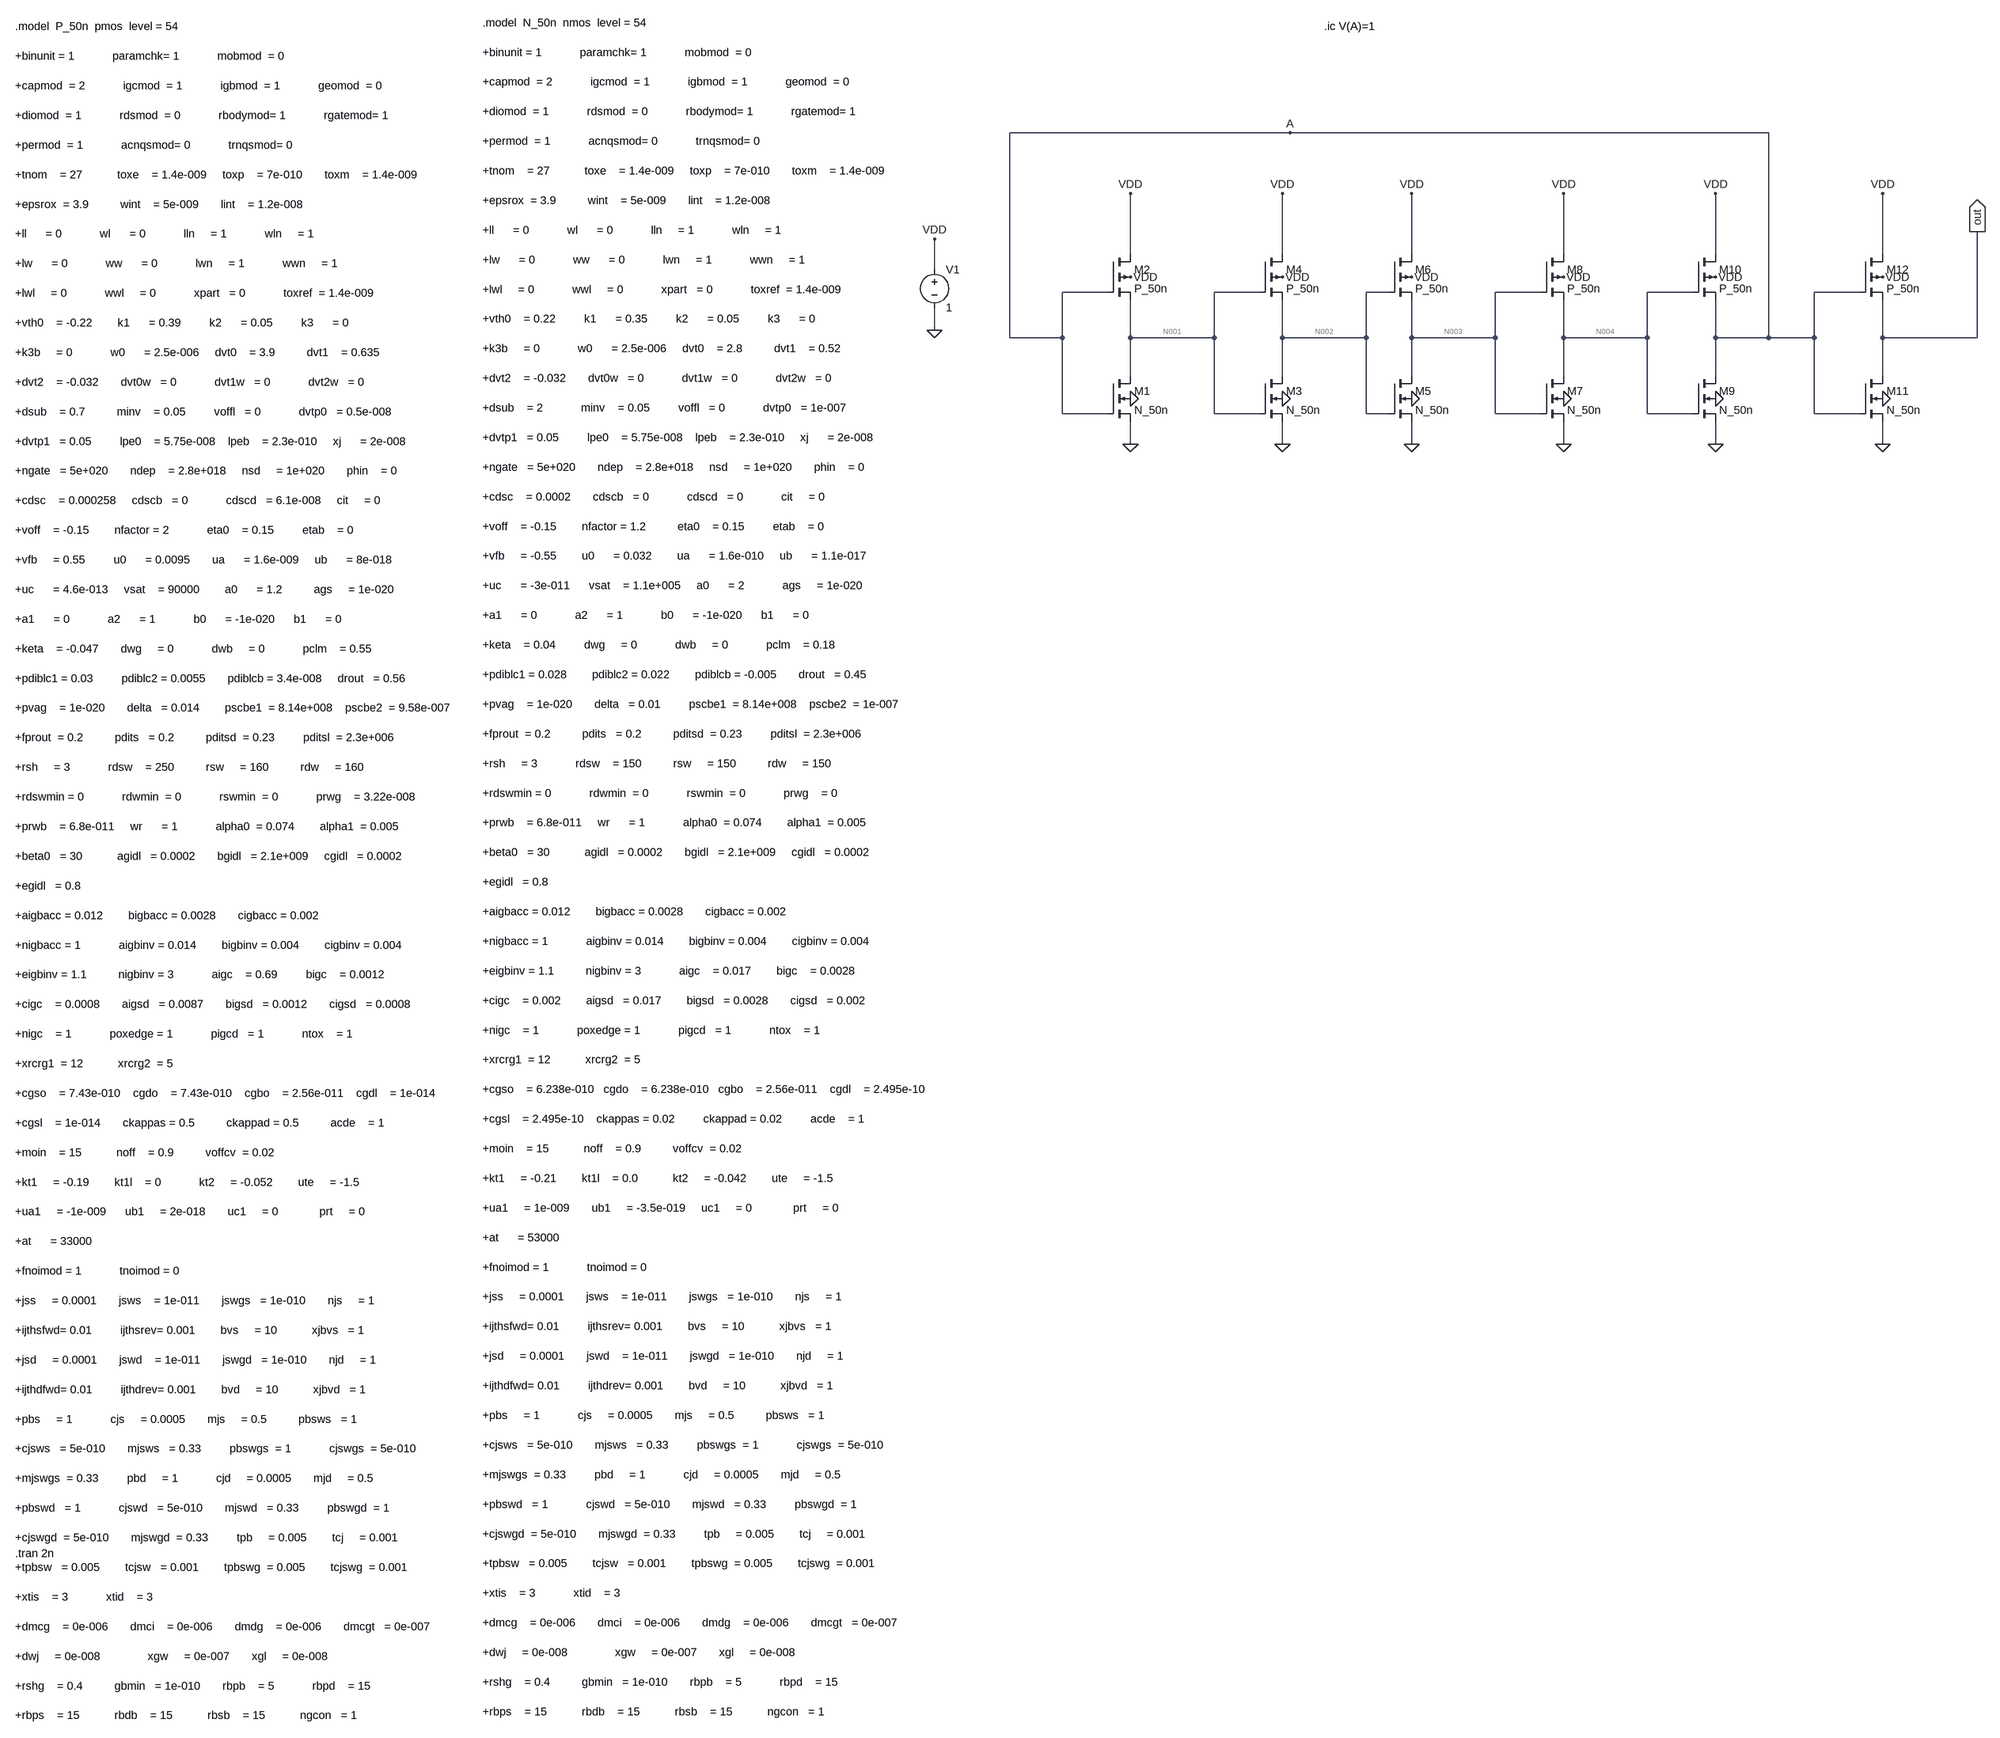
[diagram p0: schematic Draft32.asc]
Draft32.asc, the LTspice schematic file:
Version 4
SHEET 1 1432 2752
WIRE -224 -256 -816 -256
WIRE 784 -256 -224 -256
WIRE -560 0 -560 -128
WIRE -240 0 -240 -128
WIRE 32 0 32 -128
WIRE 352 0 352 -128
WIRE 672 0 672 -128
WIRE 1024 0 1024 -128
WIRE -1056 32 -1056 -32
WIRE -608 80 -704 80
WIRE -288 80 -384 80
WIRE -16 80 -64 80
WIRE 304 80 208 80
WIRE 624 80 528 80
WIRE 976 80 880 80
WIRE -1056 160 -1056 112
WIRE -816 176 -816 -256
WIRE -704 176 -704 80
WIRE -704 176 -816 176
WIRE -560 176 -560 96
WIRE -384 176 -384 80
WIRE -384 176 -560 176
WIRE -240 176 -240 96
WIRE -64 176 -64 80
WIRE -64 176 -240 176
WIRE 32 176 32 96
WIRE 208 176 208 80
WIRE 208 176 32 176
WIRE 352 176 352 96
WIRE 528 176 528 80
WIRE 528 176 352 176
WIRE 672 176 672 96
WIRE 784 176 784 -256
WIRE 784 176 672 176
WIRE 880 176 880 80
WIRE 880 176 784 176
WIRE 1024 176 1024 96
WIRE 1360 176 1360 -48
WIRE 1360 176 1024 176
WIRE -560 256 -560 176
WIRE -240 256 -240 176
WIRE 32 256 32 176
WIRE 352 256 352 176
WIRE 672 256 672 176
WIRE 1024 256 1024 176
WIRE -704 336 -704 176
WIRE -608 336 -704 336
WIRE -384 336 -384 176
WIRE -288 336 -384 336
WIRE -64 336 -64 176
WIRE -16 336 -64 336
WIRE 208 336 208 176
WIRE 304 336 208 336
WIRE 528 336 528 176
WIRE 624 336 528 336
WIRE 880 336 880 176
WIRE 976 336 880 336
WIRE -560 400 -560 352
WIRE -240 400 -240 352
WIRE 32 400 32 352
WIRE 352 400 352 352
WIRE 672 400 672 352
WIRE 1024 400 1024 352
FLAG -560 400 0
FLAG -560 304 0
FLAG -560 48 VDD
FLAG -560 -128 VDD
FLAG -240 400 0
FLAG -240 304 0
FLAG -240 48 VDD
FLAG -240 -128 VDD
FLAG 32 400 0
FLAG 32 304 0
FLAG 32 48 VDD
FLAG 32 -128 VDD
FLAG 352 400 0
FLAG 352 304 0
FLAG 352 48 VDD
FLAG 352 -128 VDD
FLAG 672 400 0
FLAG 672 304 0
FLAG 672 48 VDD
FLAG 672 -128 VDD
FLAG 1360 -48 out
IOPIN 1360 -48 Out
FLAG -1056 160 0
FLAG -1056 -32 VDD
FLAG -224 -256 A
FLAG 1024 400 0
FLAG 1024 304 0
FLAG 1024 48 VDD
FLAG 1024 -128 VDD
SYMBOL nmos4 -608 256 R0
SYMATTR InstName M1
SYMATTR Value N_50n
SYMATTR Value2 l=50N w=500N
SYMBOL pmos4 -608 0 R0
SYMATTR InstName M2
SYMATTR Value P_50n
SYMATTR Value2 l=50N w=1U
SYMBOL nmos4 -288 256 R0
SYMATTR InstName M3
SYMATTR Value N_50n
SYMATTR Value2 l=50N w=500N
SYMBOL pmos4 -288 0 R0
SYMATTR InstName M4
SYMATTR Value P_50n
SYMATTR Value2 l=50N w=1U
SYMBOL nmos4 -16 256 R0
SYMATTR InstName M5
SYMATTR Value N_50n
SYMATTR Value2 l=50N w=500N
SYMBOL pmos4 -16 0 R0
SYMATTR InstName M6
SYMATTR Value P_50n
SYMATTR Value2 l=50N w=1U
SYMBOL nmos4 304 256 R0
SYMATTR InstName M7
SYMATTR Value N_50n
SYMATTR Value2 l=50N w=500N
SYMBOL pmos4 304 0 R0
SYMATTR InstName M8
SYMATTR Value P_50n
SYMATTR Value2 l=50N w=1U
SYMBOL nmos4 624 256 R0
SYMATTR InstName M9
SYMATTR Value N_50n
SYMATTR Value2 l=50N w=500N
SYMBOL pmos4 624 0 R0
SYMATTR InstName M10
SYMATTR Value P_50n
SYMATTR Value2 l=50N w=1U
SYMBOL voltage -1056 16 R0
WINDOW 123 0 0 Left 0
WINDOW 39 0 0 Left 0
SYMATTR InstName V1
SYMATTR Value 1
SYMBOL nmos4 976 256 R0
SYMATTR InstName M11
SYMATTR Value N_50n
SYMATTR Value2 l=50N w=500N
SYMBOL pmos4 976 0 R0
SYMATTR InstName M12
SYMATTR Value P_50n
SYMATTR Value2 l=50N w=1U
TEXT -2008 -488 Left 2 !.model  N_50n  nmos  level = 54\n \n+binunit = 1            paramchk= 1            mobmod  = 0          \n \n+capmod  = 2            igcmod  = 1            igbmod  = 1            geomod  = 0          \n \n+diomod  = 1            rdsmod  = 0            rbodymod= 1            rgatemod= 1          \n \n+permod  = 1            acnqsmod= 0            trnqsmod= 0          \n \n+tnom    = 27           toxe    = 1.4e-009     toxp    = 7e-010       toxm    = 1.4e-009   \n \n+epsrox  = 3.9          wint    = 5e-009       lint    = 1.2e-008   \n \n+ll      = 0            wl      = 0            lln     = 1            wln     = 1          \n \n+lw      = 0            ww      = 0            lwn     = 1            wwn     = 1          \n \n+lwl     = 0            wwl     = 0            xpart   = 0            toxref  = 1.4e-009   \n \n+vth0    = 0.22         k1      = 0.35         k2      = 0.05         k3      = 0          \n \n+k3b     = 0            w0      = 2.5e-006     dvt0    = 2.8          dvt1    = 0.52       \n \n+dvt2    = -0.032       dvt0w   = 0            dvt1w   = 0            dvt2w   = 0          \n \n+dsub    = 2            minv    = 0.05         voffl   = 0            dvtp0   = 1e-007     \n \n+dvtp1   = 0.05         lpe0    = 5.75e-008    lpeb    = 2.3e-010     xj      = 2e-008     \n \n+ngate   = 5e+020       ndep    = 2.8e+018     nsd     = 1e+020       phin    = 0          \n \n+cdsc    = 0.0002       cdscb   = 0            cdscd   = 0            cit     = 0          \n \n+voff    = -0.15        nfactor = 1.2          eta0    = 0.15         etab    = 0          \n \n+vfb     = -0.55        u0      = 0.032        ua      = 1.6e-010     ub      = 1.1e-017   \n \n+uc      = -3e-011      vsat    = 1.1e+005     a0      = 2            ags     = 1e-020     \n \n+a1      = 0            a2      = 1            b0      = -1e-020      b1      = 0          \n \n+keta    = 0.04         dwg     = 0            dwb     = 0            pclm    = 0.18       \n \n+pdiblc1 = 0.028        pdiblc2 = 0.022        pdiblcb = -0.005       drout   = 0.45       \n \n+pvag    = 1e-020       delta   = 0.01         pscbe1  = 8.14e+008    pscbe2  = 1e-007     \n \n+fprout  = 0.2          pdits   = 0.2          pditsd  = 0.23         pditsl  = 2.3e+006   \n \n+rsh     = 3            rdsw    = 150          rsw     = 150          rdw     = 150        \n \n+rdswmin = 0            rdwmin  = 0            rswmin  = 0            prwg    = 0          \n \n+prwb    = 6.8e-011     wr      = 1            alpha0  = 0.074        alpha1  = 0.005      \n \n+beta0   = 30           agidl   = 0.0002       bgidl   = 2.1e+009     cgidl   = 0.0002     \n \n+egidl   = 0.8          \n \n+aigbacc = 0.012        bigbacc = 0.0028       cigbacc = 0.002\n \n+nigbacc = 1            aigbinv = 0.014        bigbinv = 0.004        cigbinv = 0.004\n \n+eigbinv = 1.1          nigbinv = 3            aigc    = 0.017        bigc    = 0.0028\n \n+cigc    = 0.002        aigsd   = 0.017        bigsd   = 0.0028       cigsd   = 0.002\n \n+nigc    = 1            poxedge = 1            pigcd   = 1            ntox    = 1\n \n+xrcrg1  = 12           xrcrg2  = 5          \n \n+cgso    = 6.238e-010   cgdo    = 6.238e-010   cgbo    = 2.56e-011    cgdl    = 2.495e-10     \n \n+cgsl    = 2.495e-10    ckappas = 0.02         ckappad = 0.02         acde    = 1          \n \n+moin    = 15           noff    = 0.9          voffcv  = 0.02       \n \n+kt1     = -0.21        kt1l    = 0.0           kt2     = -0.042        ute     = -1.5\n \n+ua1     = 1e-009       ub1     = -3.5e-019     uc1     = 0             prt     = 0\n \n+at      = 53000\n \n+fnoimod = 1            tnoimod = 0          \n \n+jss     = 0.0001       jsws    = 1e-011       jswgs   = 1e-010       njs     = 1          \n \n+ijthsfwd= 0.01         ijthsrev= 0.001        bvs     = 10           xjbvs   = 1          \n \n+jsd     = 0.0001       jswd    = 1e-011       jswgd   = 1e-010       njd     = 1          \n \n+ijthdfwd= 0.01         ijthdrev= 0.001        bvd     = 10           xjbvd   = 1          \n \n+pbs     = 1            cjs     = 0.0005       mjs     = 0.5          pbsws   = 1          \n \n+cjsws   = 5e-010       mjsws   = 0.33         pbswgs  = 1            cjswgs  = 5e-010     \n \n+mjswgs  = 0.33         pbd     = 1            cjd     = 0.0005       mjd     = 0.5        \n \n+pbswd   = 1            cjswd   = 5e-010       mjswd   = 0.33         pbswgd  = 1          \n \n+cjswgd  = 5e-010       mjswgd  = 0.33         tpb     = 0.005        tcj     = 0.001      \n \n+tpbsw   = 0.005        tcjsw   = 0.001        tpbswg  = 0.005        tcjswg  = 0.001      \n \n+xtis    = 3            xtid    = 3          \n \n+dmcg    = 0e-006       dmci    = 0e-006       dmdg    = 0e-006       dmcgt   = 0e-007     \n \n+dwj     = 0e-008               xgw     = 0e-007       xgl     = 0e-008     \n \n+rshg    = 0.4          gbmin   = 1e-010       rbpb    = 5            rbpd    = 15         \n \n+rbps    = 15           rbdb    = 15           rbsb    = 15           ngcon   = 1
TEXT -2992 -480 Left 2 !.model  P_50n  pmos  level = 54\n \n+binunit = 1            paramchk= 1            mobmod  = 0          \n \n+capmod  = 2            igcmod  = 1            igbmod  = 1            geomod  = 0          \n \n+diomod  = 1            rdsmod  = 0            rbodymod= 1            rgatemod= 1          \n \n+permod  = 1            acnqsmod= 0            trnqsmod= 0          \n \n+tnom    = 27           toxe    = 1.4e-009     toxp    = 7e-010       toxm    = 1.4e-009   \n \n+epsrox  = 3.9          wint    = 5e-009       lint    = 1.2e-008   \n \n+ll      = 0            wl      = 0            lln     = 1            wln     = 1          \n \n+lw      = 0            ww      = 0            lwn     = 1            wwn     = 1          \n \n+lwl     = 0            wwl     = 0            xpart   = 0            toxref  = 1.4e-009   \n \n+vth0    = -0.22        k1      = 0.39         k2      = 0.05         k3      = 0          \n \n+k3b     = 0            w0      = 2.5e-006     dvt0    = 3.9          dvt1    = 0.635        \n \n+dvt2    = -0.032       dvt0w   = 0            dvt1w   = 0            dvt2w   = 0          \n \n+dsub    = 0.7          minv    = 0.05         voffl   = 0            dvtp0   = 0.5e-008     \n \n+dvtp1   = 0.05         lpe0    = 5.75e-008    lpeb    = 2.3e-010     xj      = 2e-008     \n \n+ngate   = 5e+020       ndep    = 2.8e+018     nsd     = 1e+020       phin    = 0          \n \n+cdsc    = 0.000258     cdscb   = 0            cdscd   = 6.1e-008     cit     = 0          \n \n+voff    = -0.15        nfactor = 2            eta0    = 0.15         etab    = 0          \n \n+vfb     = 0.55         u0      = 0.0095       ua      = 1.6e-009     ub      = 8e-018     \n \n+uc      = 4.6e-013     vsat    = 90000        a0      = 1.2          ags     = 1e-020     \n \n+a1      = 0            a2      = 1            b0      = -1e-020      b1      = 0          \n \n+keta    = -0.047       dwg     = 0            dwb     = 0            pclm    = 0.55       \n \n+pdiblc1 = 0.03         pdiblc2 = 0.0055       pdiblcb = 3.4e-008     drout   = 0.56       \n \n+pvag    = 1e-020       delta   = 0.014        pscbe1  = 8.14e+008    pscbe2  = 9.58e-007  \n \n+fprout  = 0.2          pdits   = 0.2          pditsd  = 0.23         pditsl  = 2.3e+006   \n \n+rsh     = 3            rdsw    = 250          rsw     = 160          rdw     = 160        \n \n+rdswmin = 0            rdwmin  = 0            rswmin  = 0            prwg    = 3.22e-008  \n \n+prwb    = 6.8e-011     wr      = 1            alpha0  = 0.074        alpha1  = 0.005      \n \n+beta0   = 30           agidl   = 0.0002       bgidl   = 2.1e+009     cgidl   = 0.0002     \n \n+egidl   = 0.8          \n \n+aigbacc = 0.012        bigbacc = 0.0028       cigbacc = 0.002\n \n+nigbacc = 1            aigbinv = 0.014        bigbinv = 0.004        cigbinv = 0.004\n \n+eigbinv = 1.1          nigbinv = 3            aigc    = 0.69         bigc    = 0.0012\n \n+cigc    = 0.0008       aigsd   = 0.0087       bigsd   = 0.0012       cigsd   = 0.0008\n \n+nigc    = 1            poxedge = 1            pigcd   = 1            ntox    = 1\n \n+xrcrg1  = 12           xrcrg2  = 5          \n \n+cgso    = 7.43e-010    cgdo    = 7.43e-010    cgbo    = 2.56e-011    cgdl    = 1e-014     \n \n+cgsl    = 1e-014       ckappas = 0.5          ckappad = 0.5          acde    = 1          \n \n+moin    = 15           noff    = 0.9          voffcv  = 0.02       \n \n+kt1     = -0.19        kt1l    = 0            kt2     = -0.052        ute     = -1.5\n \n+ua1     = -1e-009      ub1     = 2e-018       uc1     = 0             prt     = 0\n \n+at      = 33000\n \n+fnoimod = 1            tnoimod = 0          \n \n+jss     = 0.0001       jsws    = 1e-011       jswgs   = 1e-010       njs     = 1          \n \n+ijthsfwd= 0.01         ijthsrev= 0.001        bvs     = 10           xjbvs   = 1          \n \n+jsd     = 0.0001       jswd    = 1e-011       jswgd   = 1e-010       njd     = 1          \n \n+ijthdfwd= 0.01         ijthdrev= 0.001        bvd     = 10           xjbvd   = 1          \n \n+pbs     = 1            cjs     = 0.0005       mjs     = 0.5          pbsws   = 1          \n \n+cjsws   = 5e-010       mjsws   = 0.33         pbswgs  = 1            cjswgs  = 5e-010     \n \n+mjswgs  = 0.33         pbd     = 1            cjd     = 0.0005       mjd     = 0.5        \n \n+pbswd   = 1            cjswd   = 5e-010       mjswd   = 0.33         pbswgd  = 1          \n \n+cjswgd  = 5e-010       mjswgd  = 0.33         tpb     = 0.005        tcj     = 0.001      \n \n+tpbsw   = 0.005        tcjsw   = 0.001        tpbswg  = 0.005        tcjswg  = 0.001      \n \n+xtis    = 3            xtid    = 3          \n \n+dmcg    = 0e-006       dmci    = 0e-006       dmdg    = 0e-006       dmcgt   = 0e-007     \n \n+dwj     = 0e-008               xgw     = 0e-007       xgl     = 0e-008     \n \n+rshg    = 0.4          gbmin   = 1e-010       rbpb    = 5            rbpd    = 15         \n \n+rbps    = 15           rbdb    = 15           rbsb    = 15           ngcon   = 1
TEXT -2992 2736 Left 2 !.tran 2n
TEXT -152 -480 Left 2 !.ic V(A)=1

The netlist it stands for:
* Draft32.asc
M1 N001 A 0 0 N_50n l=50N w=500N
M2 VDD A N001 VDD P_50n l=50N w=1U
M3 N002 N001 0 0 N_50n l=50N w=500N
M4 VDD N001 N002 VDD P_50n l=50N w=1U
M5 N003 N002 0 0 N_50n l=50N w=500N
M6 VDD N002 N003 VDD P_50n l=50N w=1U
M7 N004 N003 0 0 N_50n l=50N w=500N
M8 VDD N003 N004 VDD P_50n l=50N w=1U
M9 A N004 0 0 N_50n l=50N w=500N
M10 VDD N004 A VDD P_50n l=50N w=1U
V1 VDD 0 1
M11 out A 0 0 N_50n l=50N w=500N
M12 VDD A out VDD P_50n l=50N w=1U
.model NMOS NMOS
.model PMOS PMOS
.lib standard.mos
.model  N_50n  nmos  level = 54
+binunit = 1            paramchk= 1            mobmod  = 0
+capmod  = 2            igcmod  = 1            igbmod  = 1            geomod  = 0
+diomod  = 1            rdsmod  = 0            rbodymod= 1            rgatemod= 1
+permod  = 1            acnqsmod= 0            trnqsmod= 0
+tnom    = 27           toxe    = 1.4e-009     toxp    = 7e-010       toxm    = 1.4e-009
+epsrox  = 3.9          wint    = 5e-009       lint    = 1.2e-008
+ll      = 0            wl      = 0            lln     = 1            wln     = 1
+lw      = 0            ww      = 0            lwn     = 1            wwn     = 1
+lwl     = 0            wwl     = 0            xpart   = 0            toxref  = 1.4e-009
+vth0    = 0.22         k1      = 0.35         k2      = 0.05         k3      = 0
+k3b     = 0            w0      = 2.5e-006     dvt0    = 2.8          dvt1    = 0.52
+dvt2    = -0.032       dvt0w   = 0            dvt1w   = 0            dvt2w   = 0
+dsub    = 2            minv    = 0.05         voffl   = 0            dvtp0   = 1e-007
+dvtp1   = 0.05         lpe0    = 5.75e-008    lpeb    = 2.3e-010     xj      = 2e-008
+ngate   = 5e+020       ndep    = 2.8e+018     nsd     = 1e+020       phin    = 0
+cdsc    = 0.0002       cdscb   = 0            cdscd   = 0            cit     = 0
+voff    = -0.15        nfactor = 1.2          eta0    = 0.15         etab    = 0
+vfb     = -0.55        u0      = 0.032        ua      = 1.6e-010     ub      = 1.1e-017
+uc      = -3e-011      vsat    = 1.1e+005     a0      = 2            ags     = 1e-020
+a1      = 0            a2      = 1            b0      = -1e-020      b1      = 0
+keta    = 0.04         dwg     = 0            dwb     = 0            pclm    = 0.18
+pdiblc1 = 0.028        pdiblc2 = 0.022        pdiblcb = -0.005       drout   = 0.45
+pvag    = 1e-020       delta   = 0.01         pscbe1  = 8.14e+008    pscbe2  = 1e-007
+fprout  = 0.2          pdits   = 0.2          pditsd  = 0.23         pditsl  = 2.3e+006
+rsh     = 3            rdsw    = 150          rsw     = 150          rdw     = 150
+rdswmin = 0            rdwmin  = 0            rswmin  = 0            prwg    = 0
+prwb    = 6.8e-011     wr      = 1            alpha0  = 0.074        alpha1  = 0.005
+beta0   = 30           agidl   = 0.0002       bgidl   = 2.1e+009     cgidl   = 0.0002
+egidl   = 0.8
+aigbacc = 0.012        bigbacc = 0.0028       cigbacc = 0.002
+nigbacc = 1            aigbinv = 0.014        bigbinv = 0.004        cigbinv = 0.004
+eigbinv = 1.1          nigbinv = 3            aigc    = 0.017        bigc    = 0.0028
+cigc    = 0.002        aigsd   = 0.017        bigsd   = 0.0028       cigsd   = 0.002
+nigc    = 1            poxedge = 1            pigcd   = 1            ntox    = 1
+xrcrg1  = 12           xrcrg2  = 5
+cgso    = 6.238e-010   cgdo    = 6.238e-010   cgbo    = 2.56e-011    cgdl    = 2.495e-10
+cgsl    = 2.495e-10    ckappas = 0.02         ckappad = 0.02         acde    = 1
+moin    = 15           noff    = 0.9          voffcv  = 0.02
+kt1     = -0.21        kt1l    = 0.0           kt2     = -0.042        ute     = -1.5
+ua1     = 1e-009       ub1     = -3.5e-019     uc1     = 0             prt     = 0
+at      = 53000
+fnoimod = 1            tnoimod = 0
+jss     = 0.0001       jsws    = 1e-011       jswgs   = 1e-010       njs     = 1
+ijthsfwd= 0.01         ijthsrev= 0.001        bvs     = 10           xjbvs   = 1
+jsd     = 0.0001       jswd    = 1e-011       jswgd   = 1e-010       njd     = 1
+ijthdfwd= 0.01         ijthdrev= 0.001        bvd     = 10           xjbvd   = 1
+pbs     = 1            cjs     = 0.0005       mjs     = 0.5          pbsws   = 1
+cjsws   = 5e-010       mjsws   = 0.33         pbswgs  = 1            cjswgs  = 5e-010
+mjswgs  = 0.33         pbd     = 1            cjd     = 0.0005       mjd     = 0.5
+pbswd   = 1            cjswd   = 5e-010       mjswd   = 0.33         pbswgd  = 1
+cjswgd  = 5e-010       mjswgd  = 0.33         tpb     = 0.005        tcj     = 0.001
+tpbsw   = 0.005        tcjsw   = 0.001        tpbswg  = 0.005        tcjswg  = 0.001
+xtis    = 3            xtid    = 3
+dmcg    = 0e-006       dmci    = 0e-006       dmdg    = 0e-006       dmcgt   = 0e-007
+dwj     = 0e-008               xgw     = 0e-007       xgl     = 0e-008
+rshg    = 0.4          gbmin   = 1e-010       rbpb    = 5            rbpd    = 15
+rbps    = 15           rbdb    = 15           rbsb    = 15           ngcon   = 1
.model  P_50n  pmos  level = 54
+binunit = 1            paramchk= 1            mobmod  = 0
+capmod  = 2            igcmod  = 1            igbmod  = 1            geomod  = 0
+diomod  = 1            rdsmod  = 0            rbodymod= 1            rgatemod= 1
+permod  = 1            acnqsmod= 0            trnqsmod= 0
+tnom    = 27           toxe    = 1.4e-009     toxp    = 7e-010       toxm    = 1.4e-009
+epsrox  = 3.9          wint    = 5e-009       lint    = 1.2e-008
+ll      = 0            wl      = 0            lln     = 1            wln     = 1
+lw      = 0            ww      = 0            lwn     = 1            wwn     = 1
+lwl     = 0            wwl     = 0            xpart   = 0            toxref  = 1.4e-009
+vth0    = -0.22        k1      = 0.39         k2      = 0.05         k3      = 0
+k3b     = 0            w0      = 2.5e-006     dvt0    = 3.9          dvt1    = 0.635
+dvt2    = -0.032       dvt0w   = 0            dvt1w   = 0            dvt2w   = 0
+dsub    = 0.7          minv    = 0.05         voffl   = 0            dvtp0   = 0.5e-008
+dvtp1   = 0.05         lpe0    = 5.75e-008    lpeb    = 2.3e-010     xj      = 2e-008
+ngate   = 5e+020       ndep    = 2.8e+018     nsd     = 1e+020       phin    = 0
+cdsc    = 0.000258     cdscb   = 0            cdscd   = 6.1e-008     cit     = 0
+voff    = -0.15        nfactor = 2            eta0    = 0.15         etab    = 0
+vfb     = 0.55         u0      = 0.0095       ua      = 1.6e-009     ub      = 8e-018
+uc      = 4.6e-013     vsat    = 90000        a0      = 1.2          ags     = 1e-020
+a1      = 0            a2      = 1            b0      = -1e-020      b1      = 0
+keta    = -0.047       dwg     = 0            dwb     = 0            pclm    = 0.55
+pdiblc1 = 0.03         pdiblc2 = 0.0055       pdiblcb = 3.4e-008     drout   = 0.56
+pvag    = 1e-020       delta   = 0.014        pscbe1  = 8.14e+008    pscbe2  = 9.58e-007
+fprout  = 0.2          pdits   = 0.2          pditsd  = 0.23         pditsl  = 2.3e+006
+rsh     = 3            rdsw    = 250          rsw     = 160          rdw     = 160
+rdswmin = 0            rdwmin  = 0            rswmin  = 0            prwg    = 3.22e-008
+prwb    = 6.8e-011     wr      = 1            alpha0  = 0.074        alpha1  = 0.005
+beta0   = 30           agidl   = 0.0002       bgidl   = 2.1e+009     cgidl   = 0.0002
+egidl   = 0.8
+aigbacc = 0.012        bigbacc = 0.0028       cigbacc = 0.002
+nigbacc = 1            aigbinv = 0.014        bigbinv = 0.004        cigbinv = 0.004
+eigbinv = 1.1          nigbinv = 3            aigc    = 0.69         bigc    = 0.0012
+cigc    = 0.0008       aigsd   = 0.0087       bigsd   = 0.0012       cigsd   = 0.0008
+nigc    = 1            poxedge = 1            pigcd   = 1            ntox    = 1
+xrcrg1  = 12           xrcrg2  = 5
+cgso    = 7.43e-010    cgdo    = 7.43e-010    cgbo    = 2.56e-011    cgdl    = 1e-014
+cgsl    = 1e-014       ckappas = 0.5          ckappad = 0.5          acde    = 1
+moin    = 15           noff    = 0.9          voffcv  = 0.02
+kt1     = -0.19        kt1l    = 0            kt2     = -0.052        ute     = -1.5
+ua1     = -1e-009      ub1     = 2e-018       uc1     = 0             prt     = 0
+at      = 33000
+fnoimod = 1            tnoimod = 0
+jss     = 0.0001       jsws    = 1e-011       jswgs   = 1e-010       njs     = 1
+ijthsfwd= 0.01         ijthsrev= 0.001        bvs     = 10           xjbvs   = 1
+jsd     = 0.0001       jswd    = 1e-011       jswgd   = 1e-010       njd     = 1
+ijthdfwd= 0.01         ijthdrev= 0.001        bvd     = 10           xjbvd   = 1
+pbs     = 1            cjs     = 0.0005       mjs     = 0.5          pbsws   = 1
+cjsws   = 5e-010       mjsws   = 0.33         pbswgs  = 1            cjswgs  = 5e-010
+mjswgs  = 0.33         pbd     = 1            cjd     = 0.0005       mjd     = 0.5
+pbswd   = 1            cjswd   = 5e-010       mjswd   = 0.33         pbswgd  = 1
+cjswgd  = 5e-010       mjswgd  = 0.33         tpb     = 0.005        tcj     = 0.001
+tpbsw   = 0.005        tcjsw   = 0.001        tpbswg  = 0.005        tcjswg  = 0.001
+xtis    = 3            xtid    = 3
+dmcg    = 0e-006       dmci    = 0e-006       dmdg    = 0e-006       dmcgt   = 0e-007
+dwj     = 0e-008               xgw     = 0e-007       xgl     = 0e-008
+rshg    = 0.4          gbmin   = 1e-010       rbpb    = 5            rbpd    = 15
+rbps    = 15           rbdb    = 15           rbsb    = 15           ngcon   = 1
.tran 2n
.ic V(A)=1
.backanno
.end

* Results of the author's LTspice run, read from the files saved beside the schematic
* Operating Point, zero values left out:
*   V(n001) = 38.62 µV
*   V(a) = 1 V
*   V(vdd) = 1 V
*   V(n002) = 1 V
*   V(n003) = 38.62 µV
*   V(n004) = 1 V
*   V(out) = 19.59 µV
*   Id(M12) = 6.716 nA
*   Ig(M12) = 11.14 nA
*   Ib(M12) = 1.001 pA
*   Is(M12) = -17.86 nA
*   Id(M8) = 22.21 nA
*   Ig(M8) = -17.56 nA
*   Ib(M8) = 139.2 pA
*   Is(M8) = -4.786 nA
*   Id(M6) = 6.722 nA
*   Ig(M6) = 11.14 nA
*   Ib(M6) = 1 pA
*   Is(M6) = -17.86 nA
*   Id(M4) = 33.96 nA
*   Ig(M4) = -17.56 nA
*   Ib(M4) = 139.2 pA
*   Is(M4) = -16.53 nA
*   Id(M2) = 6.716 nA
*   Ig(M2) = 11.14 nA
*   Ib(M2) = 1 pA
*   Is(M2) = -17.86 nA
*   Id(M11) = 17.86 nA
*   Ig(M11) = 1.747 nA
*   Ib(M11) = -32.94 pA
*   Is(M11) = -19.57 nA
*   Id(M9) = 311.6 µA
*   Ig(M9) = 1.14 nA
*   Ib(M9) = -35.36 pA
*   Is(M9) = -311.6 µA
*   Id(M7) = 3.647 nA
*   Ig(M7) = -620.8 pA
*   Ib(M7) = -1 pA
*   Is(M7) = -3.025 nA
*   Id(M5) = 36.05 nA
*   Ig(M5) = 1.746 nA
*   Ib(M5) = -32.92 pA
*   Is(M5) = -37.76 nA
*   Id(M3) = 3.647 nA
*   Ig(M3) = -620.8 pA
*   Ib(M3) = -1 pA
*   Is(M3) = -3.025 nA
*   Id(M1) = 36.04 nA
*   Ig(M1) = 1.747 nA
*   Ib(M1) = -32.94 pA
*   Is(M1) = -37.75 nA
*   I(V1) = -76.6 nA
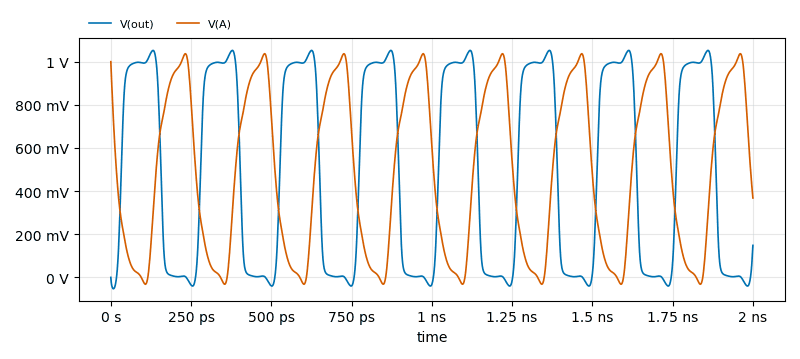
[diagram p1: Transient Analysis of Draft32.asc, plotted from the saved traces]
* Transient Analysis, 1 run:
*   V(out): min -52.84 mV, max 1.052 V, average 493.2 mV, rms 678.8 mV, last 148.5 mV
*   V(A): min -31.84 mV, max 1.037 V, average 493.8 mV, rms 627.7 mV, last 368 mV